# Altium schematic sheet Cell Terminal LPF.SchDoc
size A4; SheetNumber: 4; SheetTotal: 4
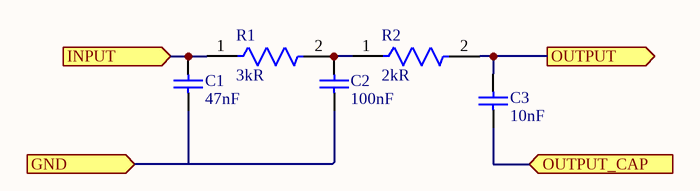
[diagram p0: Cell Terminal LPF.SchDoc]

## Parts
C1  value 47nF  [WCAP-CSGP_0402_L1W0.5H0.5]  (hidden comment: 47nF 0402 C_NTC)
C2  value 100nF  [WCAP-CSGP_0402_L1W0.5H0.5]  (hidden comment: 100nF 0402 C_NTC)
C3  value 10nF  [WCAP-CSGP_0402_L1W0.5H0.5]  (hidden comment: 10nF 0402 C_NTC)
R1  Resistance: 3kR  [FP-RT0402-0_35-MFG]  (hidden comment: 3kR 0402 0.1%)
R2  Resistance: 2kR  [FP-RT0402-0_35-MFG]  (hidden comment: 2kR 0402 0.1%)

## Ports
GND (in), INPUT (in), OUTPUT (out), OUTPUT_CAP (in)

## Nets
GND: C1.1 C2.1 ; port GND
INPUT: C1.2 R1.1 ; port INPUT
OUTPUT: C3.2 R2.2 ; port OUTPUT
OUTPUT_CAP: C3.1 ; port OUTPUT_CAP
NetC2_2: C2.2 R1.2 R2.1

## Library data of the parts
C1 = CMP-001-00864-1: WCAP-CSGP Multilayer Ceramic Chip Capacitor, General Purpose, size 0402, X7R, 47nF, 50VDC; Manufacturer Part Number: 885012205092; Manufacturer: Wurth Elektronik; Dissipation Factor: 10%; Technical Reference: X7R0402104J050DFCT10000; Rated Voltage (DC): 50V; Capacitance Tolerance: +/-5%; Insulation Resistance: 0.5GO; Ceramic Type: X7R; Design Item ID: 885012205092; Operating Temperature Max: 125°C; Width: 0.5mm; ComponentLink2URL: https://www.we-online.com/redexpert/spec/885012205092?ad; Match Code: WCAP-CSGP; Mount: Surface Mount; ComponentLink1Description: Website Link; Height: 0.5mm; Component Type: Standard; Category: Multilayer Ceramic Chip Capacitors; ComponentLink1URL: https://www.we-online.com/redexpert/article/885012205092?ad; Source: WCAP-CSGP.SchLib; Packaging: Tape and Reel; Pins: 2; ComponentLink2Description: Datasheet Link; Operating Temperature Min: -55°C; Length: 1mm; Case/Package: 0402
C2 = CMP-001-00864-1: WCAP-CSGP Multilayer Ceramic Chip Capacitor, General Purpose, size 0402, X7R, 100nF, 50VDC; Manufacturer Part Number: 885012205092; Manufacturer: Wurth Elektronik; Dissipation Factor: 10%; Technical Reference: X7R0402104J050DFCT10000; Rated Voltage (DC): 50V; Capacitance Tolerance: +/-5%; Insulation Resistance: 0.5GO; Ceramic Type: X7R; Design Item ID: 885012205092; Operating Temperature Max: 125°C; Width: 0.5mm; ComponentLink2URL: https://www.we-online.com/redexpert/spec/885012205092?ad; Match Code: WCAP-CSGP; Mount: Surface Mount; ComponentLink1Description: Website Link; Height: 0.5mm; Component Type: Standard; Category: Multilayer Ceramic Chip Capacitors; ComponentLink1URL: https://www.we-online.com/redexpert/article/885012205092?ad; Source: WCAP-CSGP.SchLib; Packaging: Tape and Reel; Pins: 2; ComponentLink2Description: Datasheet Link; Operating Temperature Min: -55°C; Length: 1mm; Case/Package: 0402
C3 = CMP-001-00864-1: WCAP-CSGP Multilayer Ceramic Chip Capacitor, General Purpose, size 0402, X7R, 10nF, 50VDC; Manufacturer Part Number: 885012205092; Manufacturer: Wurth Elektronik; Dissipation Factor: 10%; Technical Reference: X7R0402104J050DFCT10000; Rated Voltage (DC): 50V; Capacitance Tolerance: +/-5%; Insulation Resistance: 0.5GO; Ceramic Type: X7R; Design Item ID: 885012205092; Operating Temperature Max: 125°C; Width: 0.5mm; ComponentLink2URL: https://www.we-online.com/redexpert/spec/885012205092?ad; Match Code: WCAP-CSGP; Mount: Surface Mount; ComponentLink1Description: Website Link; Height: 0.5mm; Component Type: Standard; Category: Multilayer Ceramic Chip Capacitors; ComponentLink1URL: https://www.we-online.com/redexpert/article/885012205092?ad; Source: WCAP-CSGP.SchLib; Packaging: Tape and Reel; Pins: 2; ComponentLink2Description: Datasheet Link; Operating Temperature Min: -55°C; Length: 1mm; Case/Package: 0402
R1 = CMP-2002-02972-3: RES SMD 3K OHM 0.1% 1/16W 0402; Temperature Coefficient: 50ppm/°C; Voltage Rating (DC): 50V; Max Power Dissipation: 63mW; Number of Terminations: 2; Construction: Rectangular; Series: RT; Length: 0.039inch; Case Code (Metric): 1005; Military Standard: Not; Height: 0.014inch; Features: Moisture Resistant; Package Quantity: 10000; Case/Package: 0402; Lead Free: Lead Free; Width: 0.02inch; RoHS Compliant: Yes; Tolerance: 0.1%; Case Code (Imperial): 0402; Size Code: 0402; Depth: 0.5mm; Min Operating Temperature: -55°C; Max Operating Temperature: 155°C; Resistor Type: Thin Film; Power Rating: 63mW; Packaging: Tape and Reel
R2 = CMP-2002-02972-3: RES SMD 2K OHM 0.1% 1/16W 0402; Temperature Coefficient: 50ppm/°C; Voltage Rating (DC): 50V; Max Power Dissipation: 63mW; Number of Terminations: 2; Construction: Rectangular; Series: RT; Length: 0.039inch; Case Code (Metric): 1005; Military Standard: Not; Height: 0.014inch; Features: Moisture Resistant; Package Quantity: 10000; Case/Package: 0402; Lead Free: Lead Free; Width: 0.02inch; RoHS Compliant: Yes; Tolerance: 0.1%; Case Code (Imperial): 0402; Size Code: 0402; Depth: 0.5mm; Min Operating Temperature: -55°C; Max Operating Temperature: 155°C; Resistor Type: Thin Film; Power Rating: 63mW; Packaging: Tape and Reel